# Altium schematic sheet MainBoard_V100_FRP.SchDoc
size A4; SheetNumber: 1; SheetTotal: 17
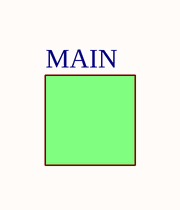
[diagram p0: MainBoard_V100_FRP.SchDoc]

## Sub-sheets
MAIN = MainBoard_V100_MAIN.SchDoc: no entries

## Notes on the sheet
- Board:
- Author:
- Title:
- Project:
- SVN:
- Version:
- Sheet:
- of
- Contact:
- Modified:
- Size:
- A4